# EAGLE schematic Phone (EAGLE 8.2.2), part 1 of 3

## Sheet 1 of 5: sensors
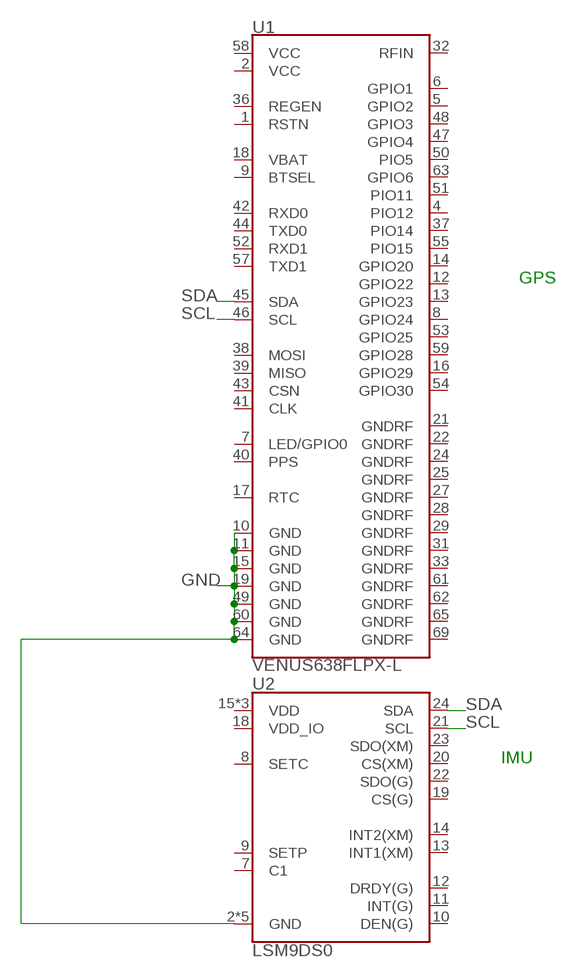
[diagram p0: schematic, sheet 1]

### Parts
U1  VENUS638FLPX-L  [VENUS638FLPX]
U2  LSM9DS0  [LGA-24]

### Nets
GND: U1.10(GND) U1.11(GND) U1.15(GND) U1.19(GND) U1.49(GND) U1.60(GND) U1.64(GND) U2.2(GND) U2.3(GND) U2.4(GND) U2.5(GND) U2.6(GND) ; also sheet 2
SCL: U1.46(SCL) U2.21(SCL) ; also sheet 2
SDA: U1.45(SDA) U2.24(SDA) ; also sheet 2
Unconnected: U1.1(RSTN) U1.2(VCC) U1.4(PIO12) U1.5(GPIO2) U1.6(GPIO1) U1.7(LED/GPIO0) U1.8(GPIO24) U1.9(BTSEL) U1.12(GPIO22) U1.13(GPIO23) U1.14(GPIO20) U1.16(GPIO29) U1.17(RTC) U1.18(VBAT) U1.21(GNDRF) U1.22(GNDRF) U1.24(GNDRF) U1.25(GNDRF) U1.27(GNDRF) U1.28(GNDRF) U1.29(GNDRF) U1.31(GNDRF) U1.32(RFIN) U1.33(GNDRF) U1.36(REGEN) U1.37(PIO14) U1.38(MOSI) U1.39(MISO) U1.40(PPS) U1.41(CLK) U1.42(RXD0) U1.43(CSN) U1.44(TXD0) U1.47(GPIO4) U1.48(GPIO3) U1.50(PIO5) U1.51(PIO11) U1.52(RXD1) U1.53(GPIO25) U1.54(GPIO30) U1.55(PIO15) U1.57(TXD1) U1.58(VCC) U1.59(GPIO28) U1.61(GNDRF) U1.62(GNDRF) U1.63(GPIO6) U1.65(GNDRF) U1.69(GNDRF) U2.7(C1) U2.8(SETC) U2.9(SETP) U2.10(DEN(G)) U2.11(INT(G)) U2.12(DRDY(G)) U2.13(INT1(XM)) U2.14(INT2(XM)) U2.15(VDD) U2.16(VDD) U2.17(VDD) U2.18(VDD_IO) U2.19(CS(G)) U2.20(CS(XM)) U2.22(SDO(G)) U2.23(SDO(XM))

### Notes on the sheet
- GPS
- IMU

## Sheet 2 of 5: IO
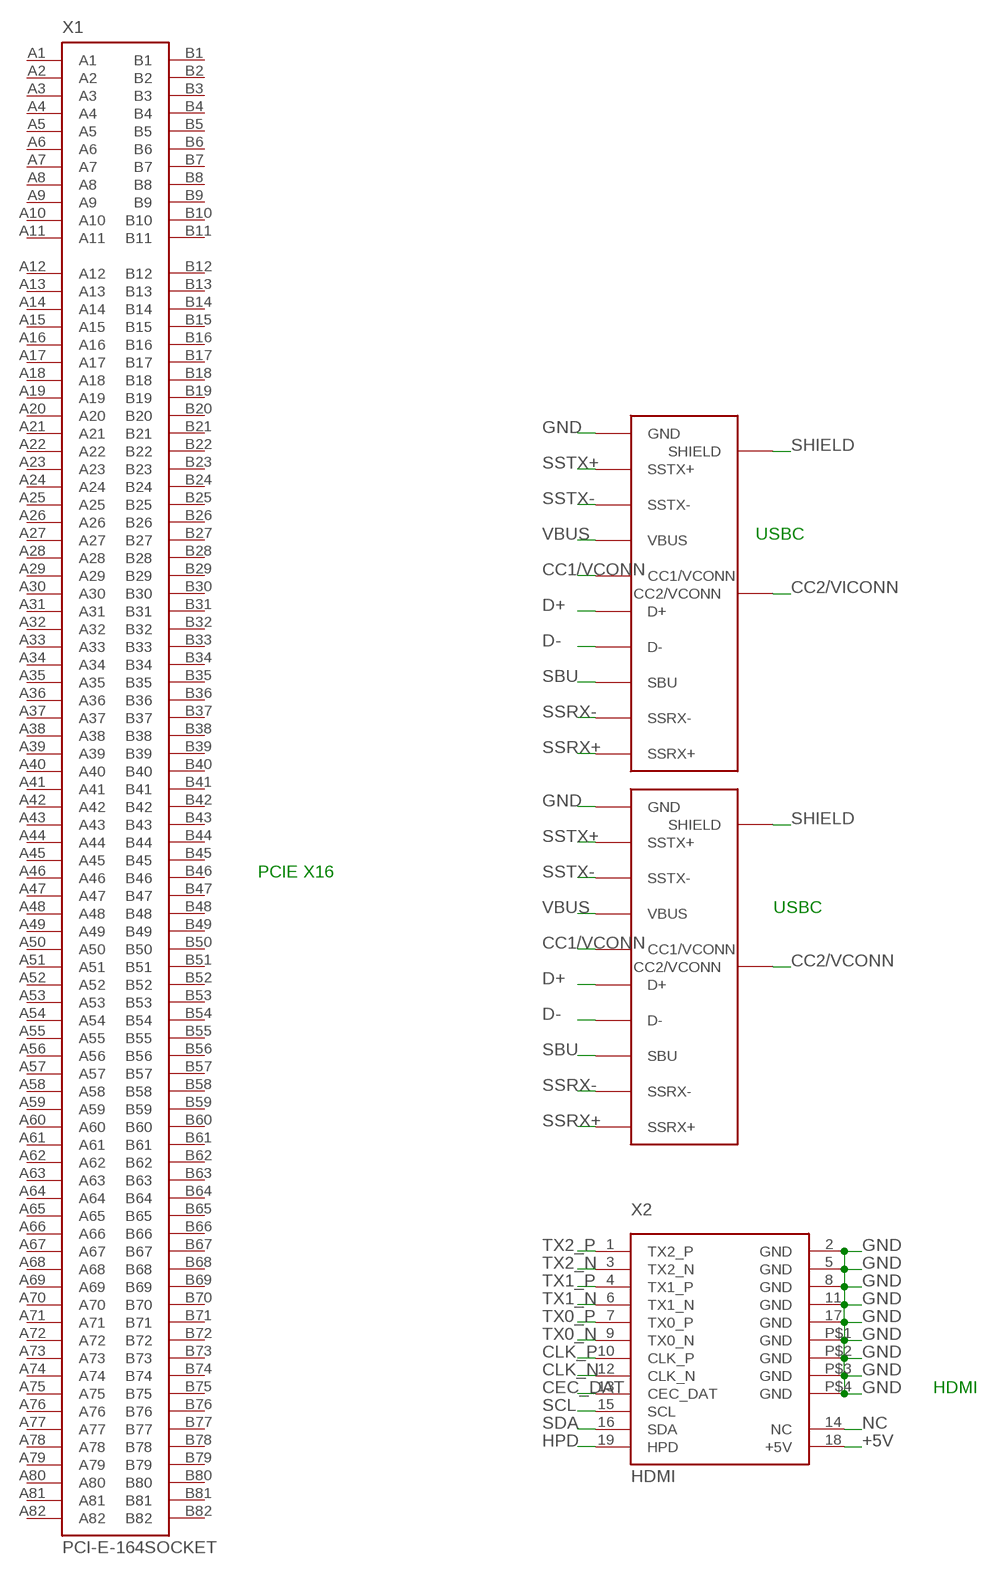
[diagram p1: schematic, sheet 2]

### Parts
U$1  USB-TYPE-C  [USB-TYPE-C-SMT]
U$2  USB-TYPE-C  [USB-TYPE-C-SMT]
X1  PCI-E-164SOCKET  [PCI-E-164]
X2  HDMI  [HDMI]

### Nets
+5V: X2.18(+5V)
CC1/VCONN: U$1.5(CC1/VCONN) U$2.5(CC1/VCONN)
CC2/VCONN: U$2.B5(CC2/VCONN)
CC2/VICONN: U$1.B5(CC2/VCONN)
CEC_DAT: X2.13(CEC_DAT)
CLK_N: X2.12(CLK_N)
CLK_P: X2.10(CLK_P)
D+: U$1.6(D+) U$1.B6(D+) U$2.6(D+) U$2.B6(D+)
D-: U$1.7(D-) U$1.B7(D-) U$2.7(D-) U$2.B7(D-)
GND: U$1.1(GND) U$1.12(GND) U$1.B1(GND) U$1.B12(GND) U$2.1(GND) U$2.12(GND) U$2.B1(GND) U$2.B12(GND) X2.2(GND) X2.5(GND) X2.8(GND) X2.11(GND) X2.17(GND) X2.P$1(GND) X2.P$2(GND) X2.P$3(GND) X2.P$4(GND) ; also sheet 1
HPD: X2.19(HPD)
NC: X2.14(NC)
SBU: U$1.8(SBU) U$1.B8(SBU) U$2.8(SBU) U$2.B8(SBU)
SCL: X2.15(SCL) ; also sheet 1
SDA: X2.16(SDA) ; also sheet 1
SHIELD: U$1.P$1(SHIELD) U$1.P$2(SHIELD) U$1.P$3(SHIELD) U$1.P$4(SHIELD) U$1.P$5(SHIELD) U$1.P$6(SHIELD) U$1.P$7(SHIELD) U$1.P$8(SHIELD) U$1.P$9(SHIELD) U$1.P$10(SHIELD) U$1.P$11(SHIELD) U$1.P$12(SHIELD) U$1.P$13(SHIELD) U$1.P$14(SHIELD) U$1.P$15(SHIELD) U$1.P$16(SHIELD) U$1.P$17(SHIELD) U$1.P$18(SHIELD) U$1.P$19(SHIELD) U$1.P$20(SHIELD) U$1.P$21(SHIELD) U$1.P$22(SHIELD) U$1.P$23(SHIELD) U$1.P$24(SHIELD) U$1.P$25(SHIELD) U$1.P$26(SHIELD) U$1.P$27(SHIELD) U$1.P$28(SHIELD) U$2.P$1(SHIELD) U$2.P$2(SHIELD) U$2.P$3(SHIELD) U$2.P$4(SHIELD) U$2.P$5(SHIELD) U$2.P$6(SHIELD) U$2.P$7(SHIELD) U$2.P$8(SHIELD) U$2.P$9(SHIELD) U$2.P$10(SHIELD) U$2.P$11(SHIELD) U$2.P$12(SHIELD) U$2.P$13(SHIELD) U$2.P$14(SHIELD) U$2.P$15(SHIELD) U$2.P$16(SHIELD) U$2.P$17(SHIELD) U$2.P$18(SHIELD) U$2.P$19(SHIELD) U$2.P$20(SHIELD) U$2.P$21(SHIELD) U$2.P$22(SHIELD) U$2.P$23(SHIELD) U$2.P$24(SHIELD) U$2.P$25(SHIELD) U$2.P$26(SHIELD) U$2.P$27(SHIELD) U$2.P$28(SHIELD)
SSRX+: U$1.11(SSRX+) U$1.B11(SSRX+) U$2.11(SSRX+) U$2.B11(SSRX+)
SSRX-: U$1.10(SSRX-) U$1.B10(SSRX-) U$2.10(SSRX-) U$2.B10(SSRX-)
SSTX+: U$1.2(SSTX+) U$1.B2(SSTX+) U$2.2(SSTX+) U$2.B2(SSTX+)
SSTX-: U$1.3(SSTX-) U$1.B3(SSTX-) U$2.3(SSTX-) U$2.B3(SSTX-)
TX0_N: X2.9(TX0_N)
TX0_P: X2.7(TX0_P)
TX1_N: X2.6(TX1_N)
TX1_P: X2.4(TX1_P)
TX2_N: X2.3(TX2_N)
TX2_P: X2.1(TX2_P)
VBUS: U$1.4(VBUS) U$1.9(VBUS) U$1.B4(VBUS) U$1.B9(VBUS) U$2.4(VBUS) U$2.9(VBUS) U$2.B4(VBUS) U$2.B9(VBUS)
Unconnected: X1.A1 X1.A2 X1.A3 X1.A4 X1.A5 X1.A6 X1.A7 X1.A8 X1.A9 X1.A10 X1.A11 X1.A12 X1.A13 X1.A14 X1.A15 X1.A16 X1.A17 X1.A18 X1.A19 X1.A20 X1.A21 X1.A22 X1.A23 X1.A24 X1.A25 X1.A26 X1.A27 X1.A28 X1.A29 X1.A30 X1.A31 X1.A32 X1.A33 X1.A34 X1.A35 X1.A36 X1.A37 X1.A38 X1.A39 X1.A40 X1.A41 X1.A42 X1.A43 X1.A44 X1.A45 X1.A46 X1.A47 X1.A48 X1.A49 X1.A50 X1.A51 X1.A52 X1.A53 X1.A54 X1.A55 X1.A56 X1.A57 X1.A58 X1.A59 X1.A60 X1.A61 X1.A62 X1.A63 X1.A64 X1.A65 X1.A66 X1.A67 X1.A68 X1.A69 X1.A70 X1.A71 X1.A72 X1.A73 X1.A74 X1.A75 X1.A76 X1.A77 X1.A78 X1.A79 X1.A80 X1.A81 X1.A82 X1.B1 X1.B2 X1.B3 X1.B4 X1.B5 X1.B6 X1.B7 X1.B8 X1.B9 X1.B10 X1.B11 X1.B12 X1.B13 X1.B14 X1.B15 X1.B16 X1.B17 X1.B18 X1.B19 X1.B20 X1.B21 X1.B22 X1.B23 X1.B24 X1.B25 X1.B26 X1.B27 X1.B28 X1.B29 X1.B30 X1.B31 X1.B32 X1.B33 X1.B34 X1.B35 X1.B36 X1.B37 X1.B38 X1.B39 X1.B40 X1.B41 X1.B42 X1.B43 X1.B44 X1.B45 X1.B46 X1.B47 X1.B48 X1.B49 X1.B50 X1.B51 X1.B52 X1.B53 X1.B54 X1.B55 X1.B56 X1.B57 X1.B58 X1.B59 X1.B60 X1.B61 X1.B62 X1.B63 X1.B64 X1.B65 X1.B66 X1.B67 X1.B68 X1.B69 X1.B70 X1.B71 X1.B72 X1.B73 X1.B74 X1.B75 X1.B76 X1.B77 X1.B78 X1.B79 X1.B80 X1.B81 X1.B82

### Notes on the sheet
- USBC
- PCIE X16
- USBC
- HDMI

## Sheet 3 of 5: power

## Sheet 4 of 5: audio
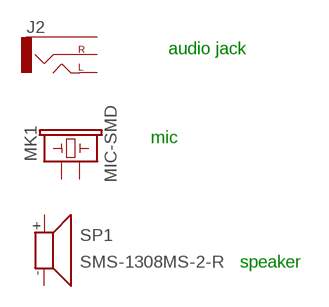
[diagram p2: schematic, sheet 4]

### Parts
J2  AUDIO_JACK_2.5MM_2.5MM  [STEREOJACK2.5MM_STEREOJACK2.5MM]
MK1  MIC-SMD  [MICROPHONE-SMD-6MM]
SP1  SMS-1308MS-2-R  [SMS-1308MS-2-R]
Unconnected: J2.RING1(SLEEVE) J2.SHIELD(LEFT) J2.TIP(RIGHT) MK1.1 MK1.2 SP1.+ SP1.-

### Notes on the sheet
- audio jack
- mic
- speaker

## Sheet 5 of 5: CPU
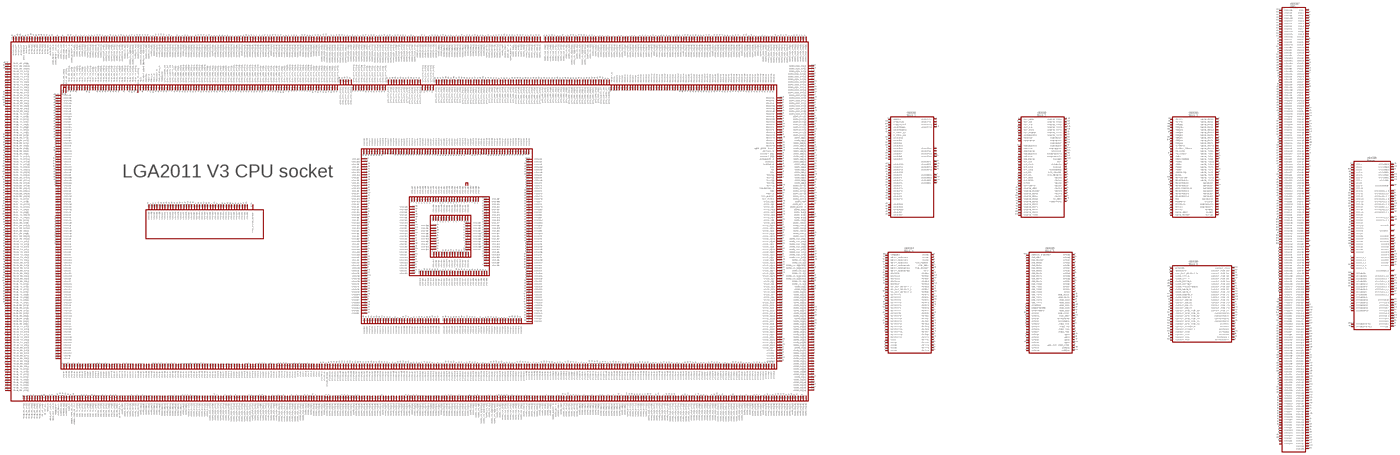
[diagram p3: schematic, sheet 5, overview]
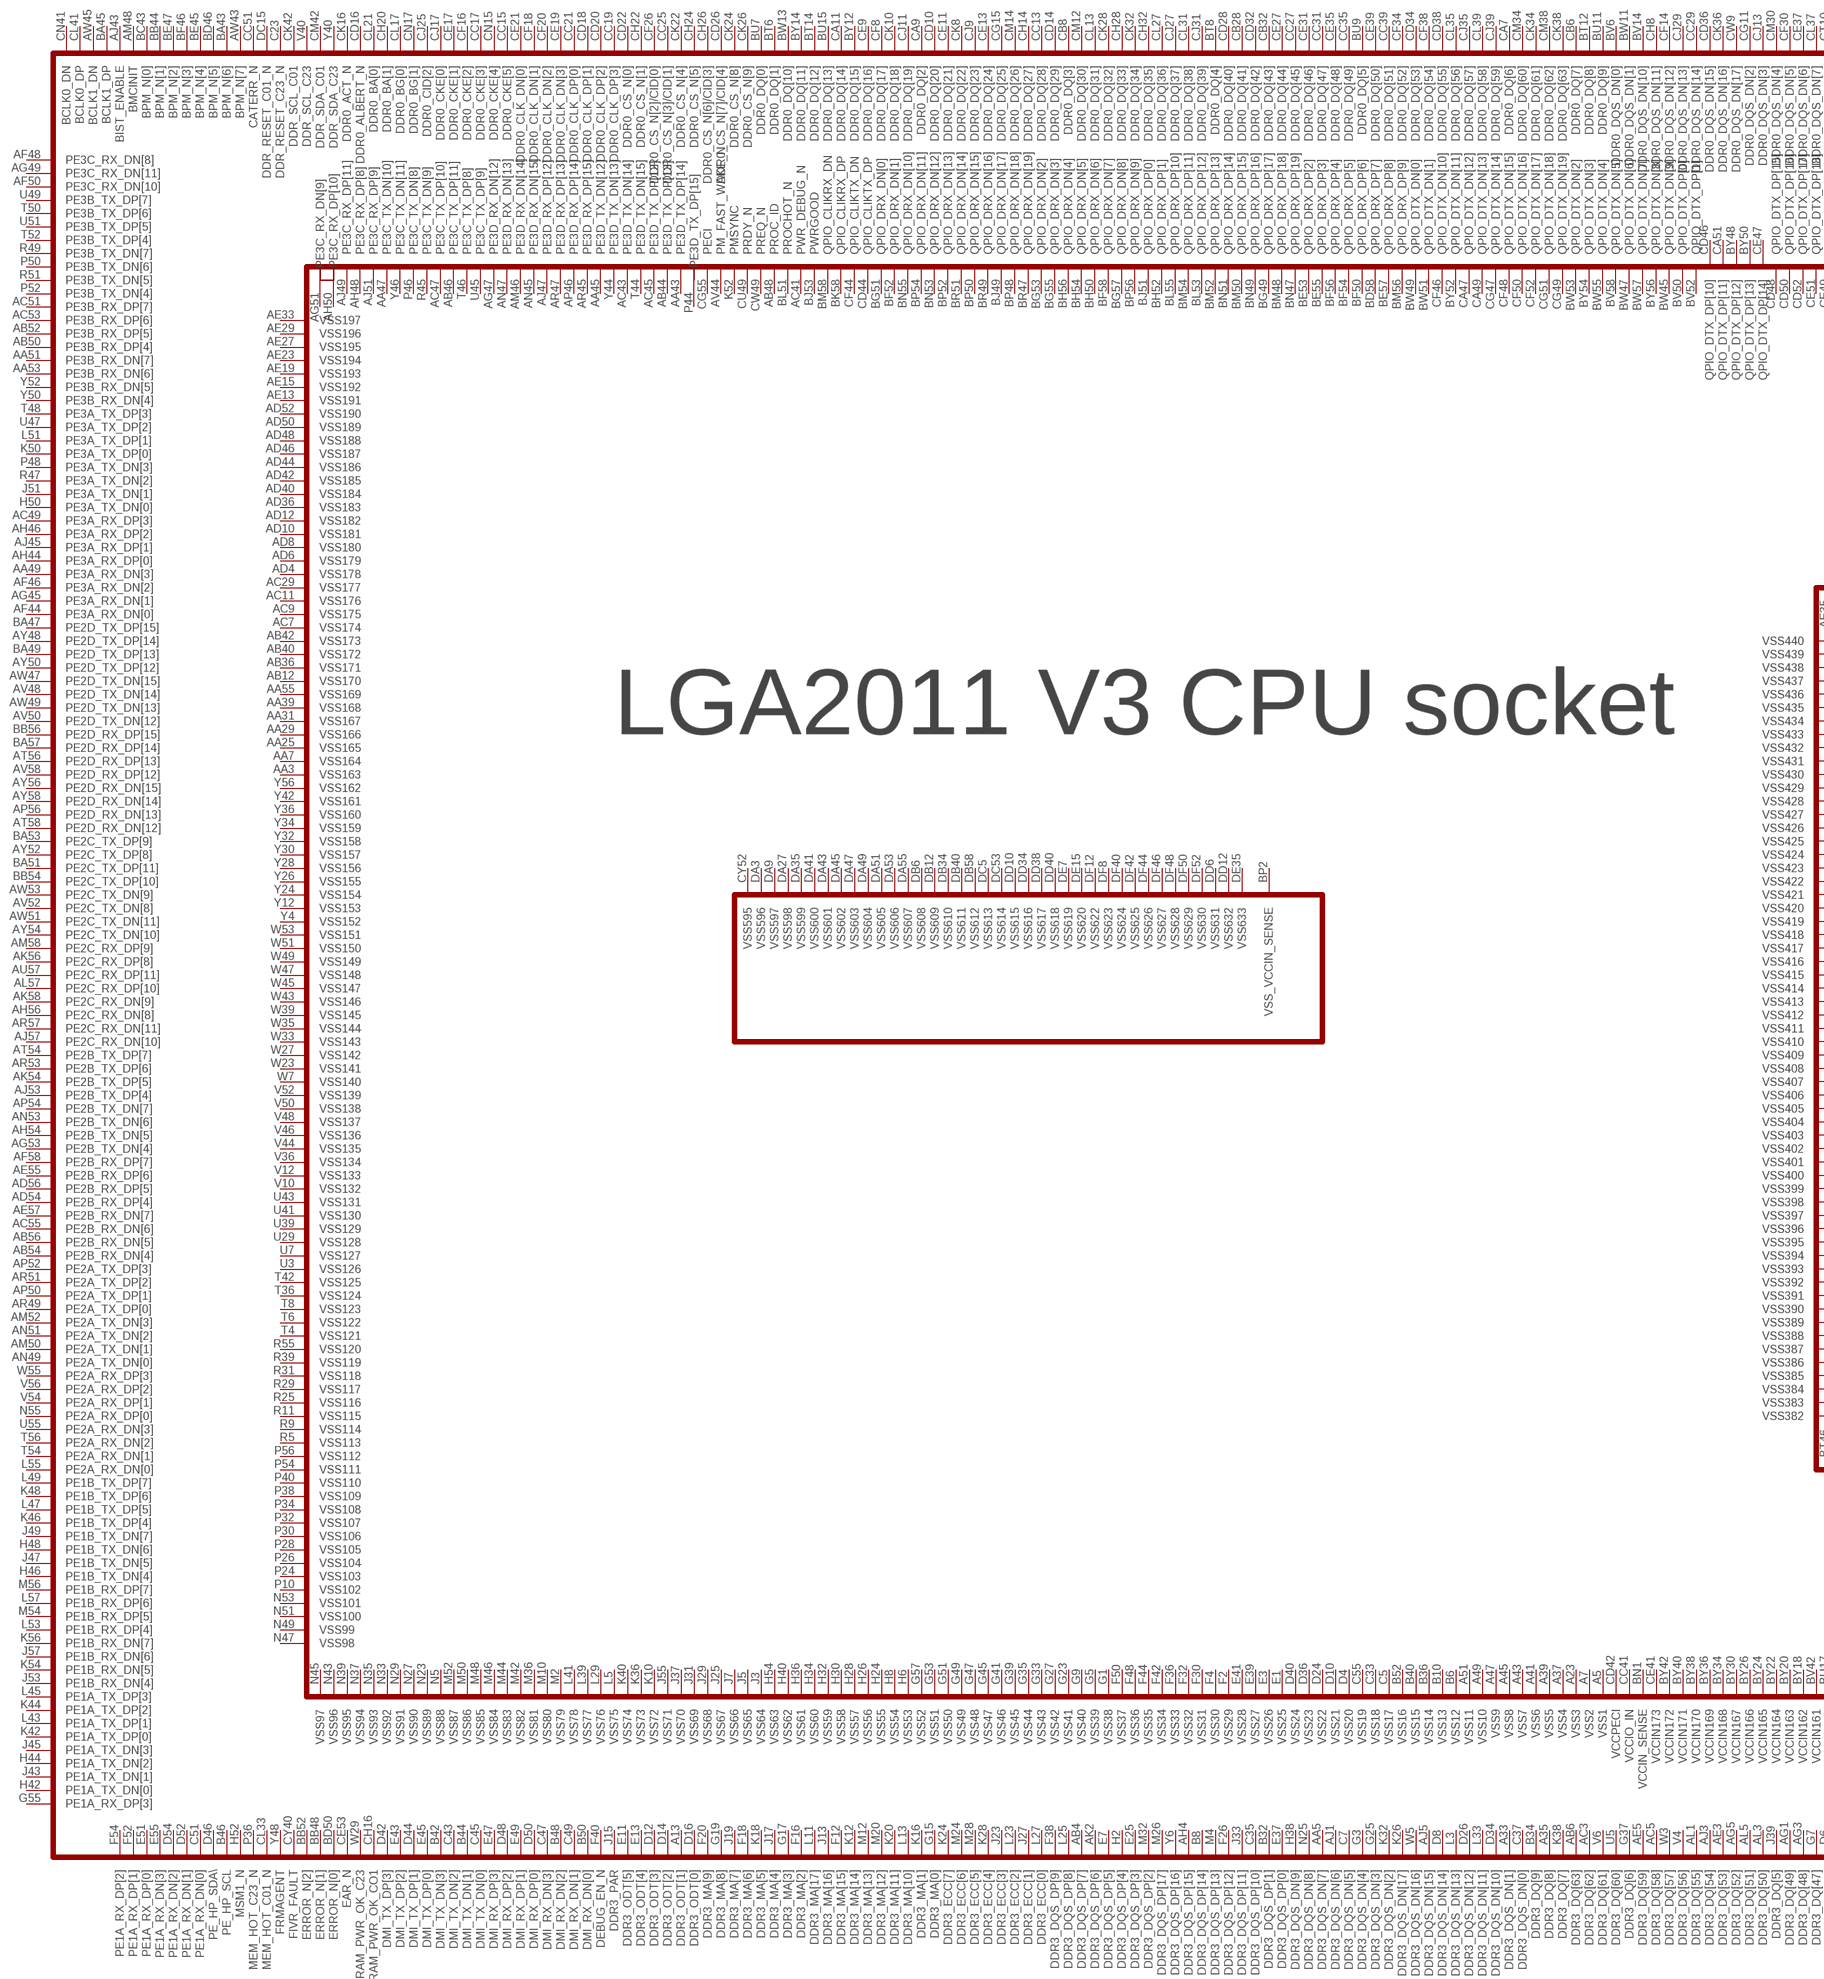
[diagram p4: schematic, sheet 5, part 1 of 4]
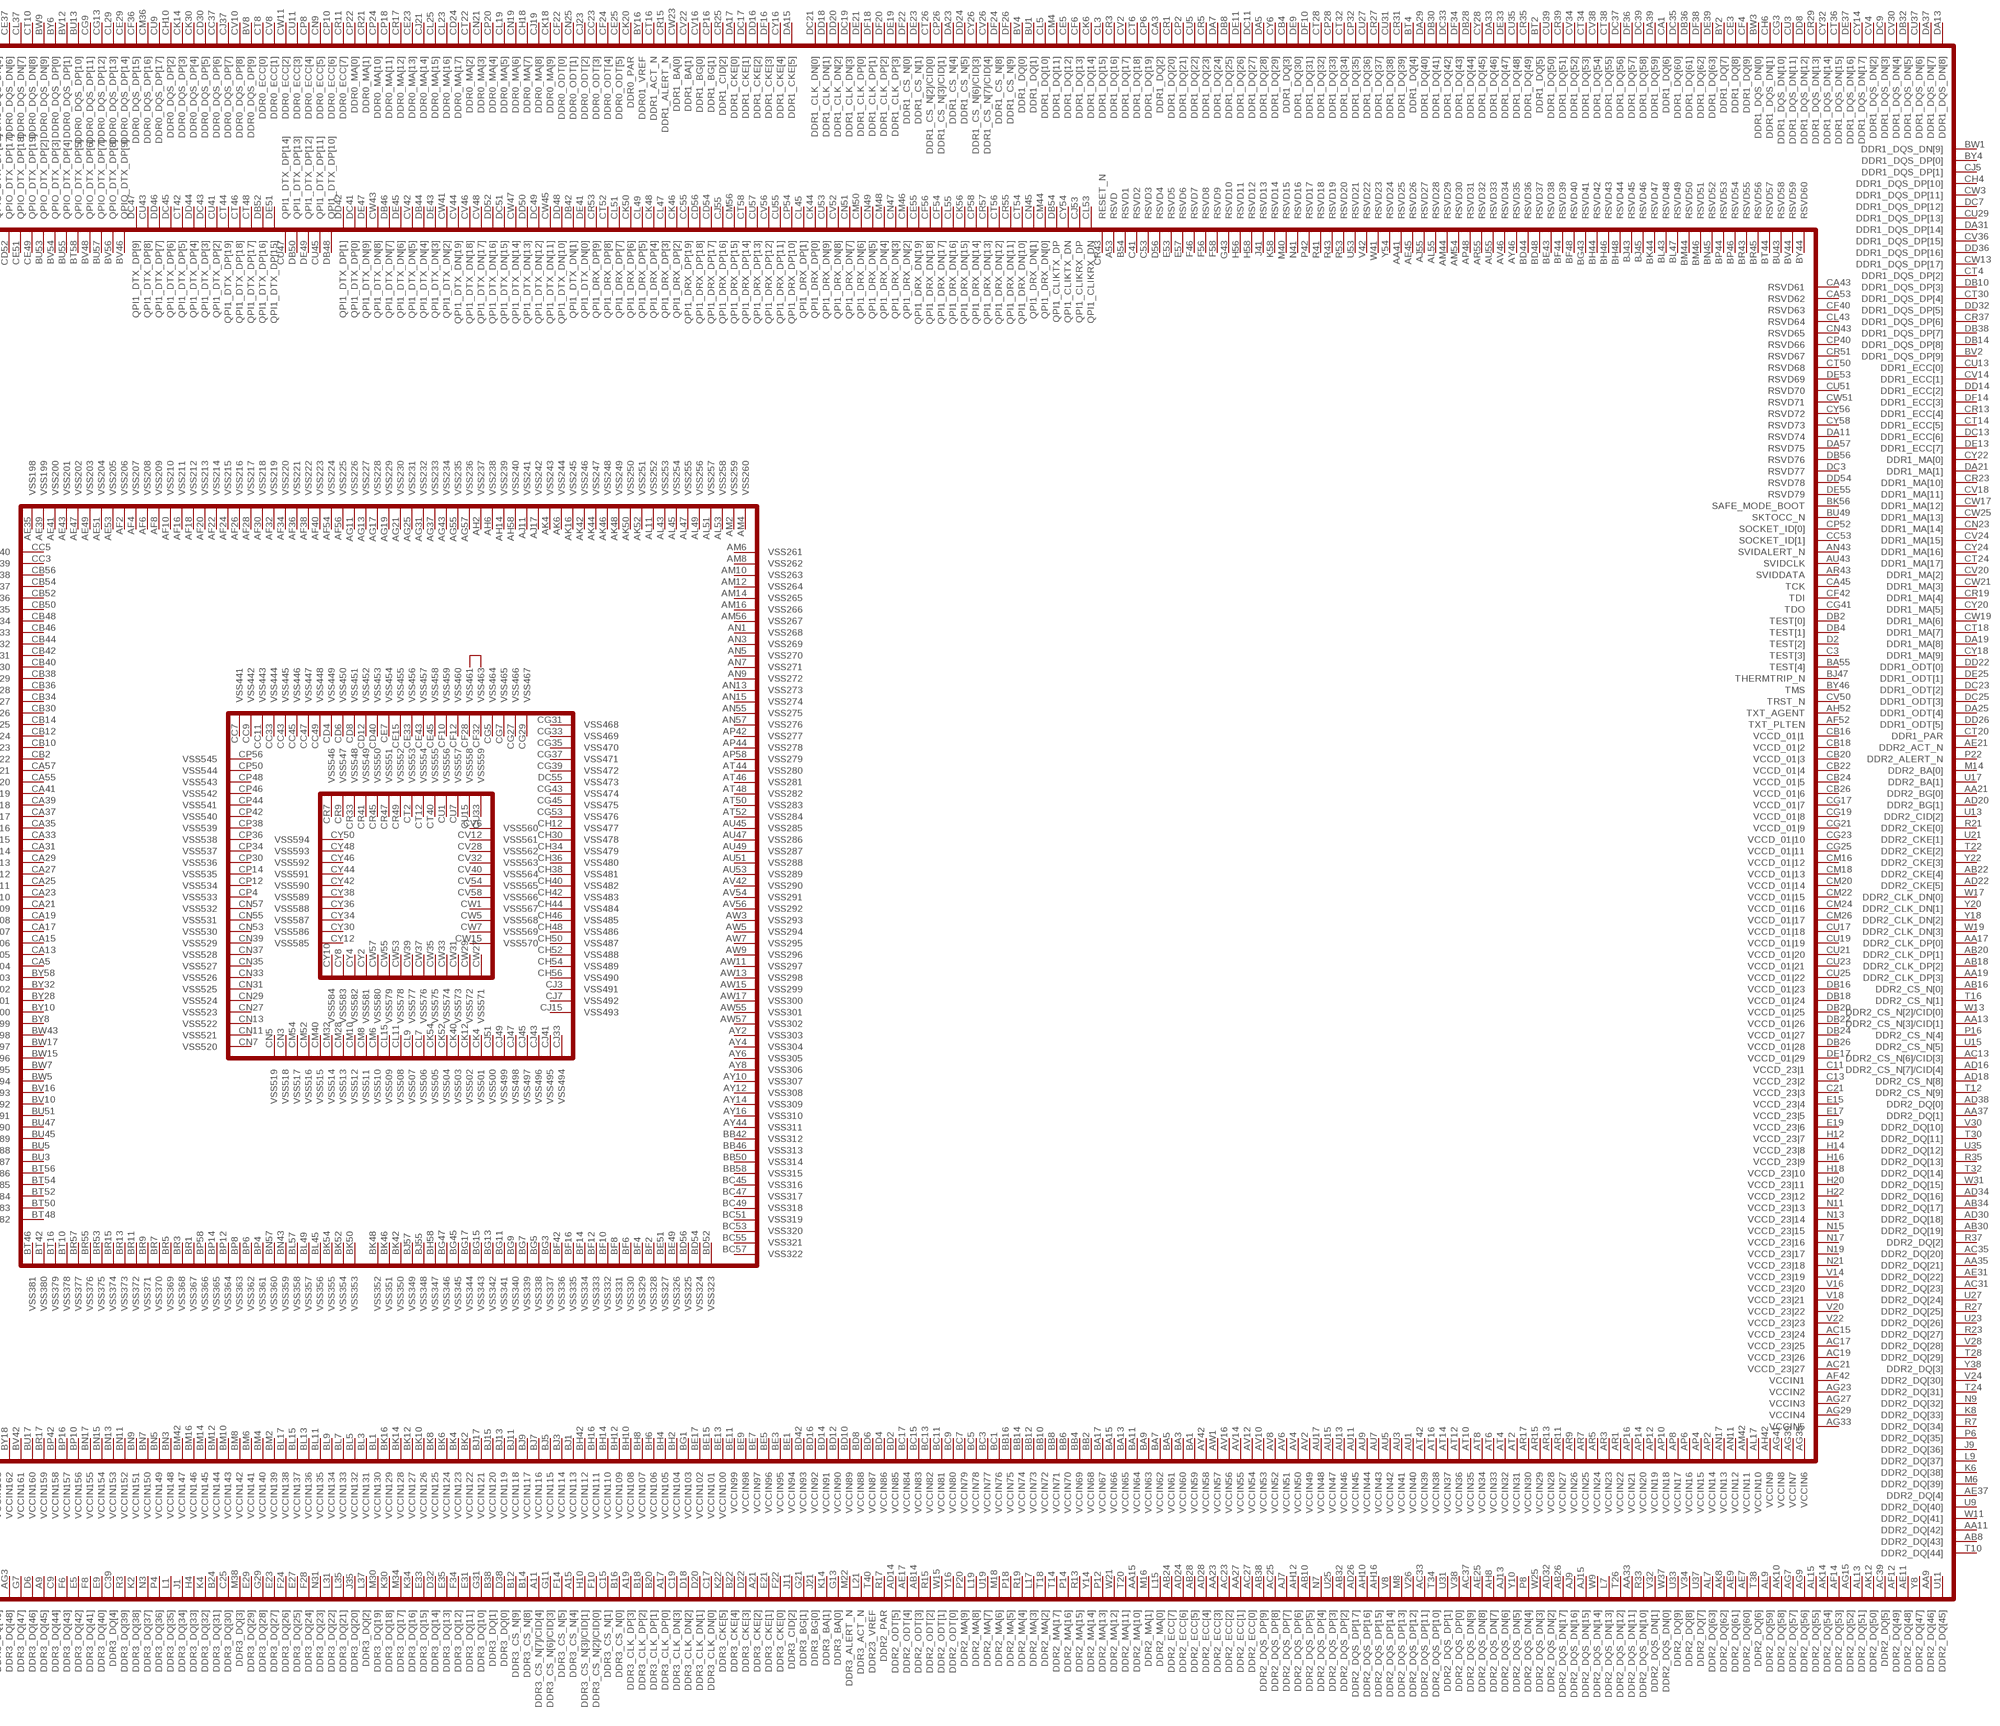
[diagram p5: schematic, sheet 5, part 2 of 4]
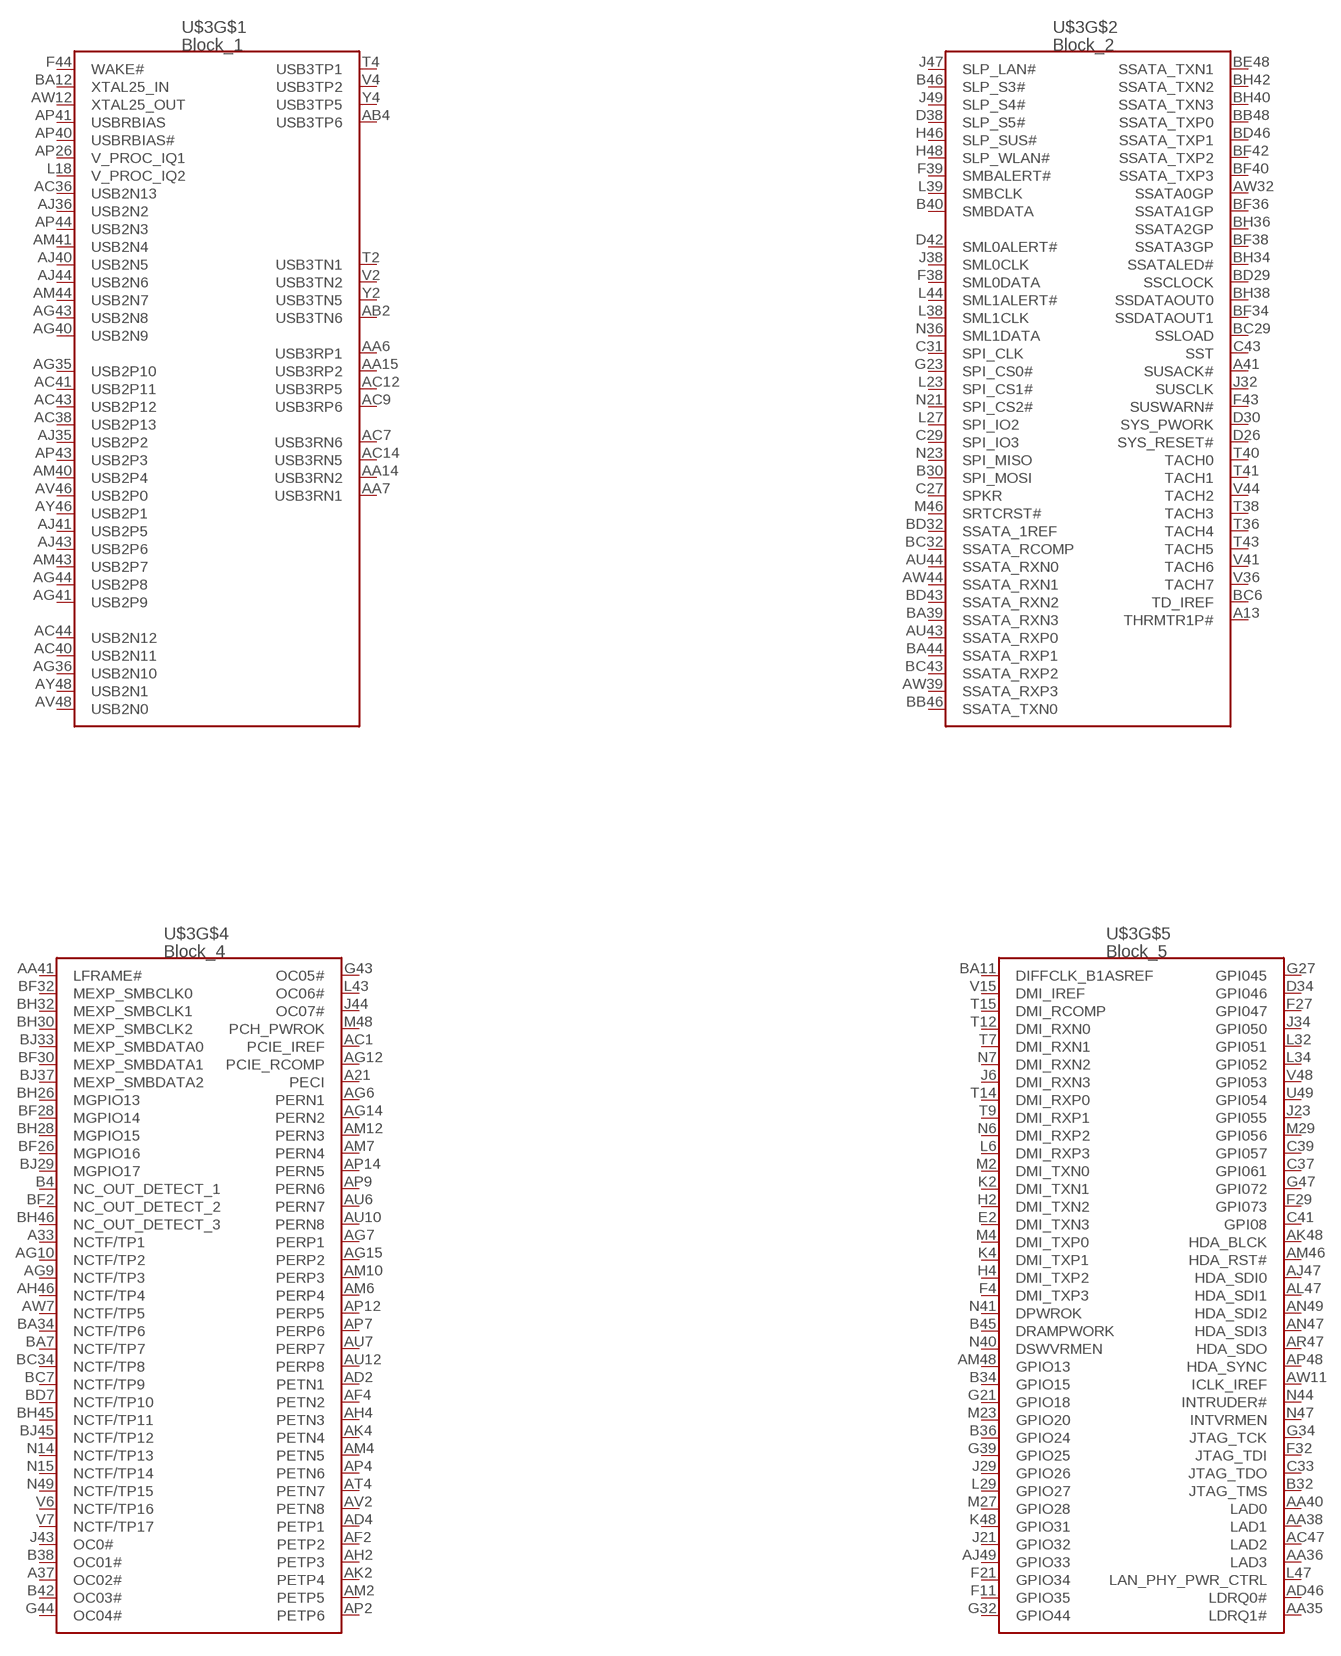
[diagram p6: schematic, sheet 5, part 3 of 4]
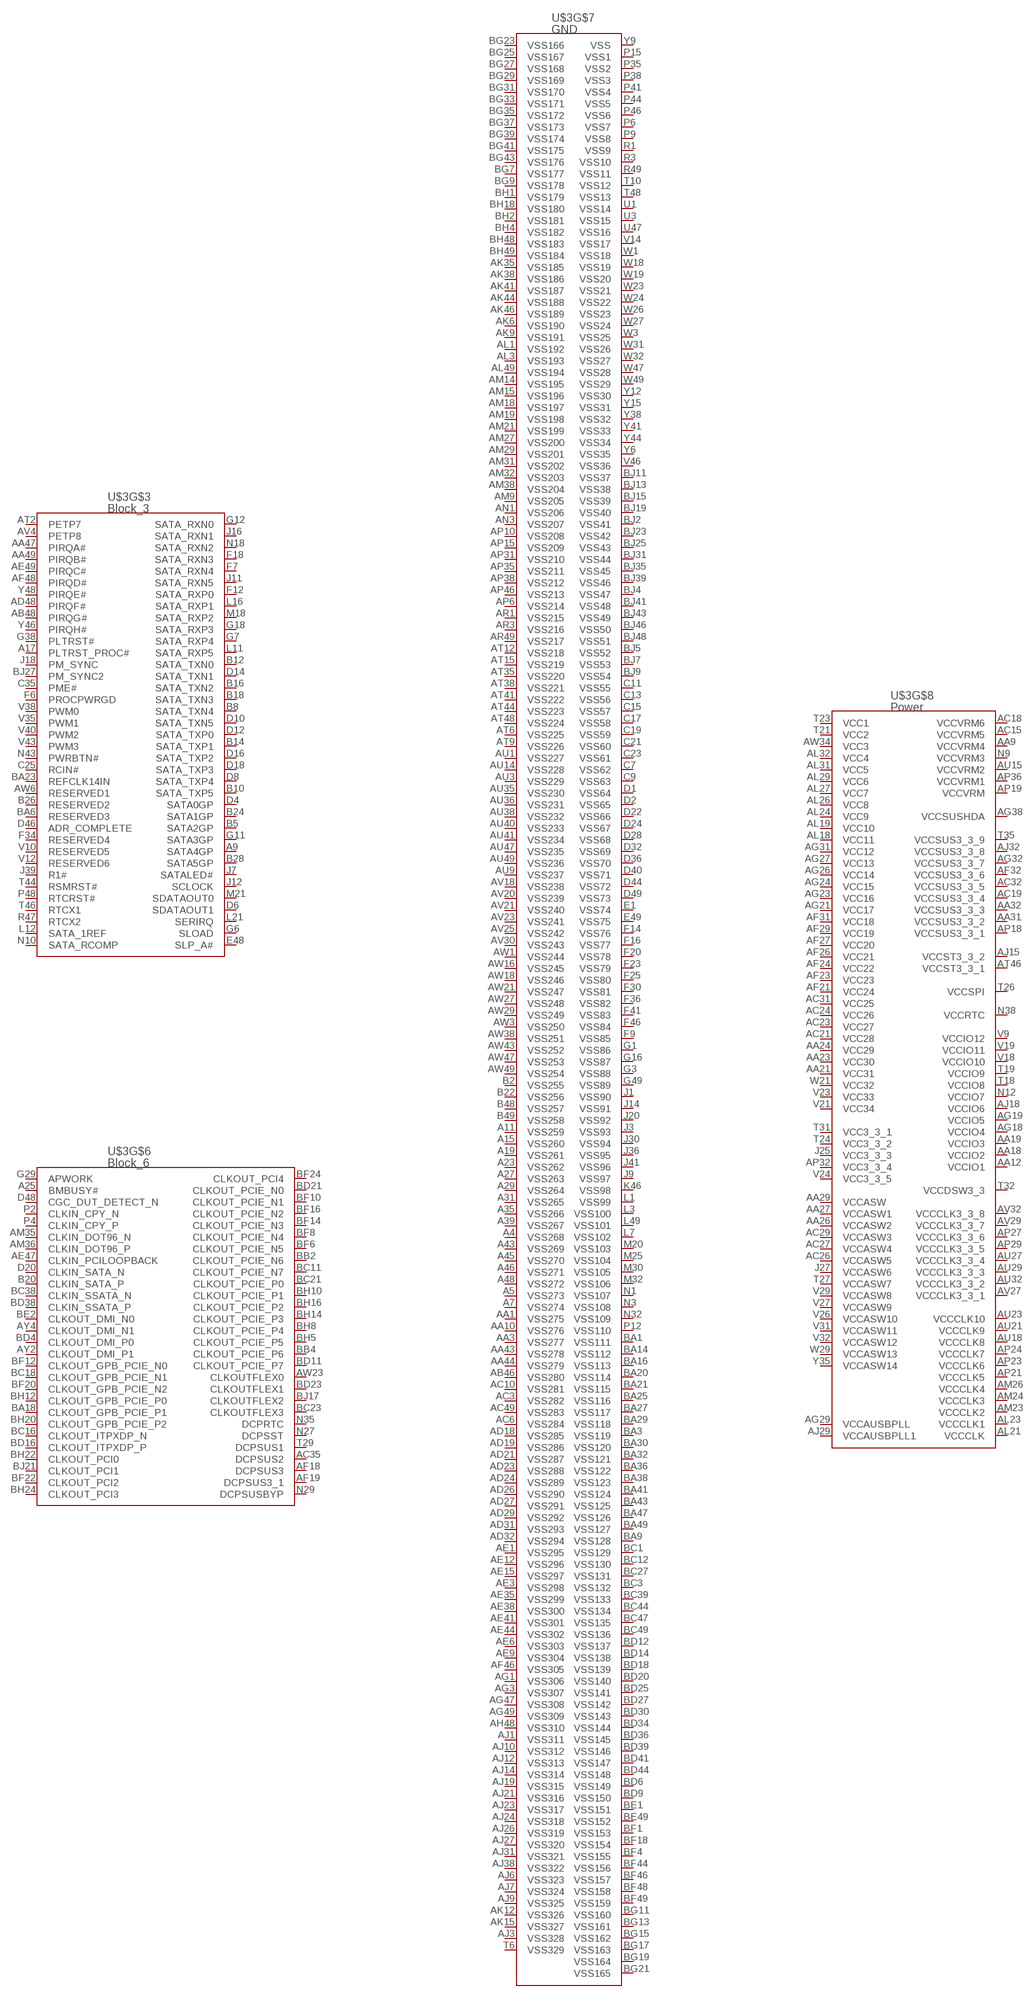
[diagram p7: schematic, sheet 5, part 4 of 4]

### Parts
IC1  LGA2011V3SOCKET  [LGA2011]
U$3  C610_X99  [X99]